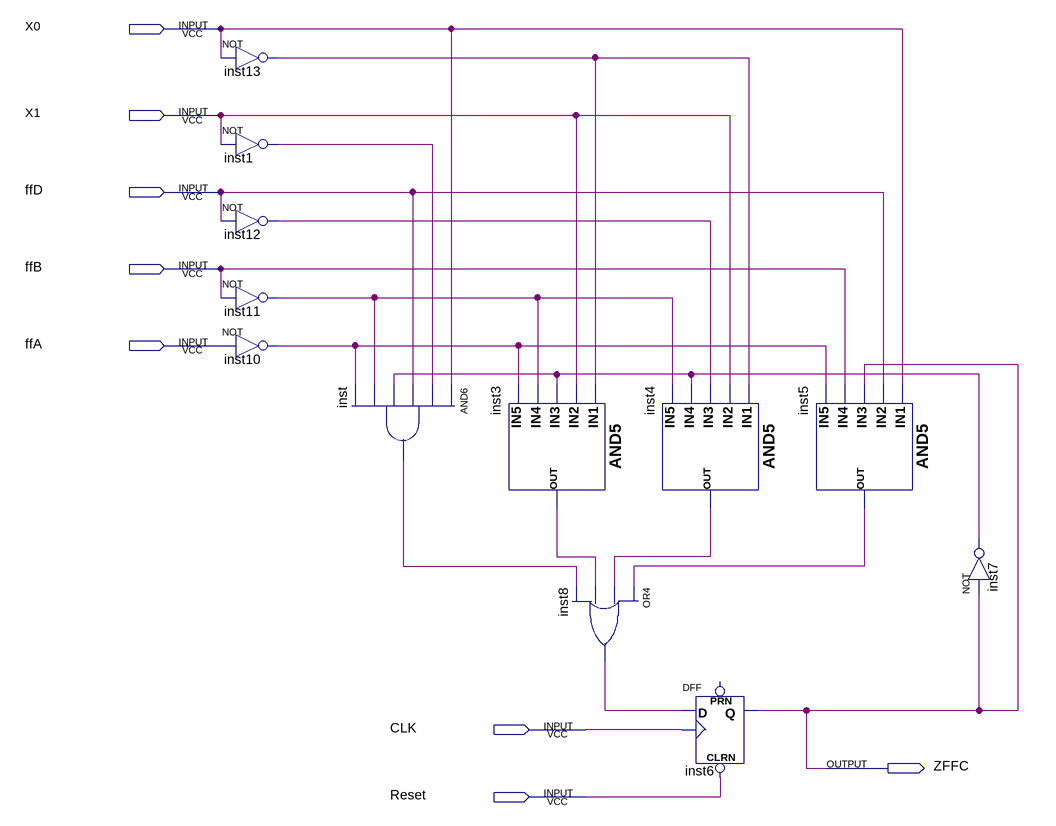
[diagram p0: schematic sheet]
// Quartus schematic EquacaoFFC.bdf as structural Verilog: 12 symbols, 8 pins
module EquacaoFFC (
  input  X0,
  input  X1,
  input  ffD,
  input  ffB,
  input  ffA,
  input  CLK,
  input  Reset,
  output ZFFC
);

  wire inst1_out, inst3_out, inst4_out, inst5_out, inst7_out, inst8_out, inst10_out, inst11_out, inst12_out,
       inst13_out, inst_out;

  not inst13 (inst13_out, X0);
  not inst1 (inst1_out, X1);
  not inst12 (inst12_out, ffD);
  not inst11 (inst11_out, ffB);
  not inst10 (inst10_out, ffA);
  and inst (inst_out, X0, inst1_out, ffD, inst7_out, inst11_out, inst10_out);
  and inst3 (inst3_out, inst13_out, X1, inst7_out, inst11_out, inst10_out);
  or inst8 (inst8_out, inst5_out, inst4_out, inst3_out, inst_out);
  and inst4 (inst4_out, inst13_out, X1, inst12_out, inst7_out, inst11_out);
  DFF inst6 (.CLRN(Reset), .CLK(CLK), .D(inst8_out), .Q(ZFFC));  // open: PRN
  and inst5 (inst5_out, X0, ffD, ZFFC, ffB, inst10_out);
  not inst7 (inst7_out, ZFFC);
endmodule
